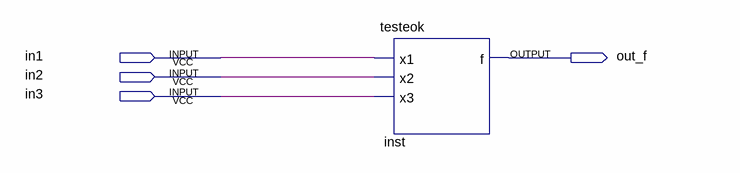
[diagram p0: schematic sheet]
// Quartus schematic projetoBCC.bdf as structural Verilog: 1 symbols, 4 pins
module projetoBCC (
  input  in1,
  input  in2,
  input  in3,
  output out_f
);

  testeok inst (.x1(in1), .x2(in2), .x3(in3), .f(out_f));
endmodule
